# EAGLE design BeatleCPU6 (EAGLE 9.2.0)
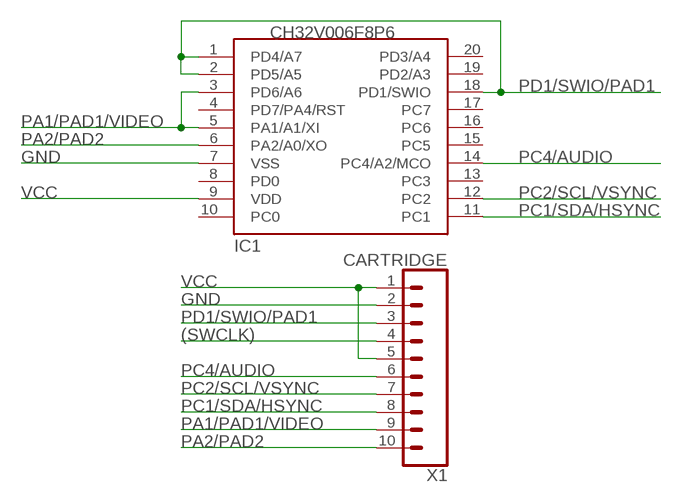
[diagram p0: schematic, sheet 1]

## Parts
IC1  CH32V006F8P6  [TSSOP20]
X1  CARTRIDGE  CONN_10  [1X10_LONGPADS]

## Nets
(SWCLK): X1.4
GND: IC1.7(VSS) X1.2
PA1/PAD1/VIDEO: IC1.3(PD6/A6) IC1.5(PA1/A1/XI) X1.9
PA2/PAD2: IC1.6(PA2/A0/XO) X1.10
PC1/SDA/HSYNC: IC1.11(PC1) X1.8
PC2/SCL/VSYNC: IC1.12(PC2) X1.7
PC4/AUDIO: IC1.14(PC4/A2/MCO) X1.6
PD1/SWIO/PAD1: IC1.1(PD4/A7) IC1.2(PD5/A5) IC1.18(PD1/SWIO) X1.3
VCC: IC1.9(VDD) X1.1 X1.5
Unconnected: IC1.4(PD7/PA4/RST) IC1.8(PD0) IC1.10(PC0) IC1.13(PC3) IC1.15(PC5) IC1.16(PC6) IC1.17(PC7) IC1.19(PD2/A3) IC1.20(PD3/A4)

## Library data of the parts
IC1 = CH32V:CH32V006F8P6
X1 = SparkFun-Connectors:CONN_10: Multi connection point. Often used as Generic Header-pin footprint for 0.1 inch spaced/style header connections On any of the 0.1 inch spaced packages, you can populate with these: Break Away Headers - Straight <https://www.sparkfun.com/products/116> (PRT-00116) Break Away Male Headers - Right Angle <https://www.sparkfun.com/products/553> (PRT-00553) Female Headers <https://www.sparkfun.com/products/115> (PRT-00115) Break Away Headers - Machine Pin <https://www.sparkfun.com/products/117> (PRT-00117) Break Away Female Headers - Swiss Machine Pin <https://www.sparkfun.com/products/743> (PRT-00743) Arduino Stackable Header - 10 Pin <https://www.sparkfun.com/products/11376> (PRT-11376) For SCREWTERMINALS and SPRING TERMINALS visit here: Screw Terimnals on SparkFun.com <https://www.sparkfun.com/search/results?term=Screw+Terminals> (5mm/3.5mm/2.54mm spacing) This device is also useful as a general connection point to wire up your design to another part of your project. Our various solder wires solder well into these plated through hole pads. Hook-Up Wire - Assortment (Stranded, 22 AWG) <https://www.sparkfun.com/products/11375> (PRT-11375) Hook-Up Wire - Assortment (Solid Core, 22 AWG) <https://www.sparkfun.com/products/11367> (PRT-11367) View the entire wire category on our website here <https://www.sparkfun.com/categories/141> Special notes: Molex polarized connector foot print use with SKU : PRT-08231 with associated crimp pins and housings. 1MM SMD Version SKU: PRT-10208 NOTES ON THE VARIANTS LOCK and LOCK_LONGPADS... This footprint was designed to help hold the alignment of a through-hole component (i.e. 6-pin header) while soldering it into place. You may notice that each hole has been shifted either up or down by 0.005 of an inch from it's more standard position (which is a perfectly straight line). This slight alteration caused the pins (the squares in the middle) to touch the edges of the holes. Because they are alternating, it causes a "brace" to hold the component in place. 0.005 has proven to be the perfect amount of "off-center" position when using our standard breakaway headers. Although looks a little odd when you look at the bare footprint, once you have a header in there, the alteration is very hard to notice. Also,if you push a header all the way into place, it is covered up entirely on the bottom side.

## Board
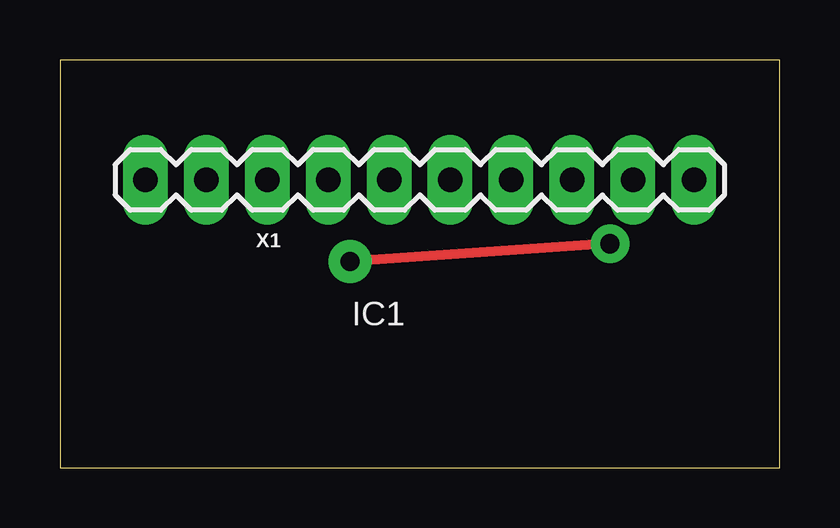
[diagram p1: board, top side]
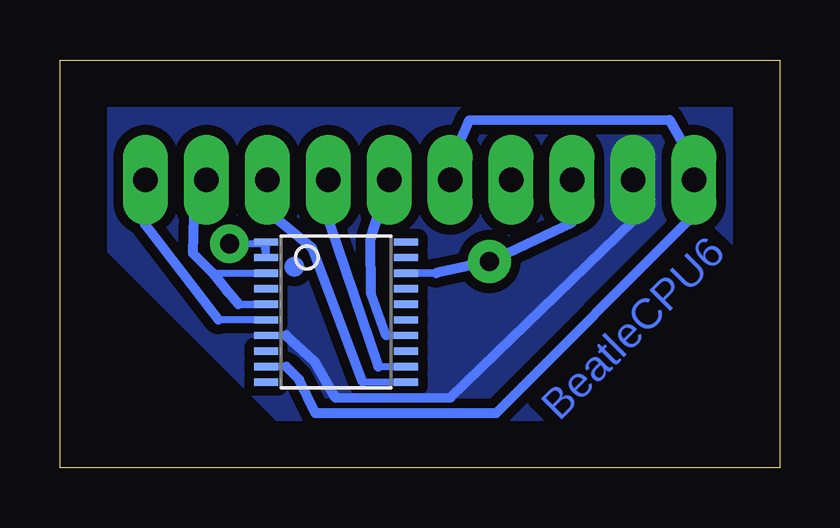
[diagram p2: board, bottom side, seen from below]

Size 30 x 17 mm. Coordinates in mm from the lower left corner, seen from the top.
Outline: 0,0 30,0 30,17 0,17 0,0
Copper layers (1*16): Top 0.035mm / dielectric 1.5mm / Bottom 0.035mm
Design rules "default": minimum track width 6mil, minimum drill 0.35mm, track to track 6mil, track to pad 6mil, pad to pad 6mil, via to via 6mil, smd to smd 6mil, copper to edge 40mil, drill to drill 6mil, minimum pad ring 10mil, minimum via ring 8mil, stop-mask expansion 4mil, vias tented up to drill 0mil, thermal gap 10mil

### Footprints (pad centres in the part's own frame; a part is rotated, then mirrored left to right if it is on the bottom)
TSSOP20 = smd 0.305 x 0.991: 1 -2.925,-2.918; 2 -2.275,-2.918; 3 -1.625,-2.918; 4 -0.975,-2.918; 5 -0.325,-2.918; 6 0.325,-2.918; 7 0.975,-2.918; 8 1.625,-2.918; 9 2.275,-2.918; 10 2.925,-2.918; 11 2.925,2.918; 12 2.275,2.918; 13 1.625,2.918; 14 0.975,2.918; 15 0.325,2.918; 16 -0.325,2.918; 17 -0.975,2.918; 18 -1.625,2.918; 19 -2.275,2.918; 20 -2.925,2.918
1X10_LONGPADS = drill 1.016 pad 1.88 long: 1 -11.43,0; 2 -8.89,0; 3 -6.35,0; 4 -3.81,0; 5 -1.27,0; 6 1.27,0; 7 3.81,0; 8 6.35,0; 9 8.89,0; 10 11.43,0

### Placement (x,y rotation side)
IC1  18.49,6.48 270 bottom
X1  15,12 0 top

### Tracks (layer width: path | path; a pad name or v marks a point on that pad's centre or on a via)
GND
  Bottom 0.305: 20.57,5.51 IC1.7
  Bottom 0.406: X1.2 6.1,10.3 13.71,2.92 18.52,2.91 19.38,4.42 20.57,5.51
  pour Bottom (isolate 0.406, no thermals): 9,2 2,9 2,15 28,15 28,9 21,2
PA1/PAD1/VIDEO
  Bottom 0.305: 23.61,8.1 IC1.3 | 22.55,6.8 IC1.5
  Bottom 0.406: X1.9 24.42,10.5 24.47,8.95 23.61,8.1 23.04,7.36 22.55,6.8
PA2/PAD2
  Bottom 0.305: 23.4,6.17 IC1.6
  Bottom 0.406: X1.10 26.46,10.14 23.4,6.17
PC1/SDA/HSYNC
  Bottom 0.305: IC1.11 17.38,3.58
  Bottom 0.406: 17.38,3.58 19.48,9.14 21.24,10.59 X1.8
PC2/SCL/VSYNC
  Bottom 0.305: IC1.12 16.73,4.2
  Bottom 0.406: 16.73,4.2 18.79,10.26 X1.7
PC4/AUDIO
  Bottom 0.305: IC1.14 16.4,5.51
  Bottom 0.406: 16.4,5.51 17.04,7.26 17.04,9.53 X1.6
PD1/SWIO/PAD1  (via drill 0.8 pad 1.6, 0.8 pad 1.8)
  Top 0.406: v22.93,9.34 v12.1,8.59
  Bottom 0.305: IC1.1 IC1.2 21.49,9.33 v22.93,9.34 | 14.32,8.11 IC1.18
  Bottom 0.406: 14.32,8.11 v12.1,8.59 8.66,10.21 X1.3
VCC
  Bottom 0.305: 20.56,4.21 IC1.9
  Bottom 0.406: X1.5 13.73,12.66 12.94,14.48 4.58,14.5 3.62,12.79 X1.1 3.59,10.51 11.81,2.27 19.35,2.27 20.02,3.67 20.56,4.21
(copper drawn outside any net)
  shapes: Bottom circle x1

### Text on the board
Bottom: BeatleCPU6
tDocu: 1 | 10